# Altium schematic sheet USB 3.SchDoc
size 420 x 297 mm; SheetNumber: 6; SheetTotal: 7
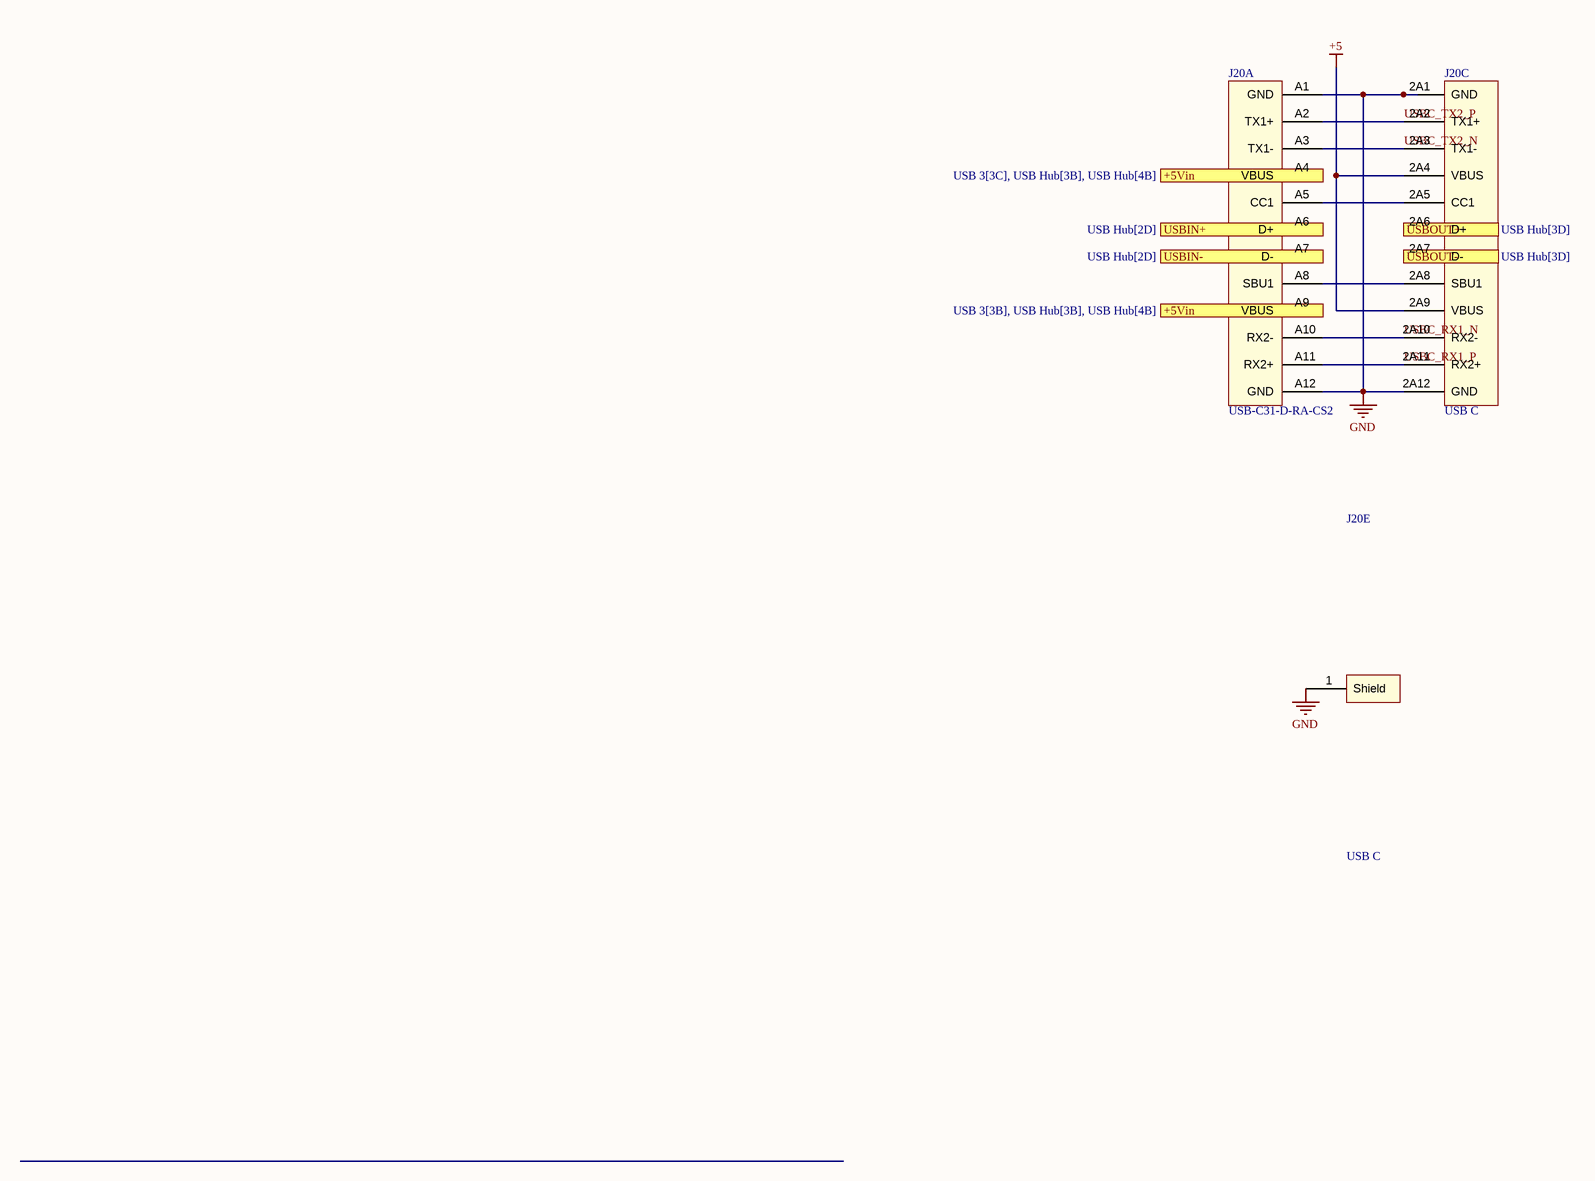
[diagram p0: USB 3.SchDoc]

## Parts
J20  USB-C31-D-RA-CS2  [Dual USB C Connector]  (parts A,C,E of 5)

## Ports
+5Vin (see USB 3[3B], USB Hub[3B], USB Hub[4B]), +5Vin (see USB 3[3C], USB Hub[3B], USB Hub[4B]), USBIN+ (see USB Hub[2D]), USBIN- (see USB Hub[2D]), USBOUT+ (see USB Hub[3D]), USBOUT- (see USB Hub[3D])

## Nets
+5: J20.2A4(VBUS) J20.2A9(VBUS)
GND: J20.1(Shield) J20.2A1(GND) J20.2A12(GND) J20.A1(GND) J20.A12(GND)
+5Vin: J20.A4(VBUS) J20.A9(VBUS) ; port +5Vin
USBC_RX1_N: J20.2A10(RX2-) J20.A10(RX2-)
USBC_RX1_P: J20.2A11(RX2+) J20.A11(RX2+)
USBC_TX2_N: J20.2A3(TX1-) J20.A3(TX1-)
USBC_TX2_P: J20.2A2(TX1+) J20.A2(TX1+)
USBIN+: J20.A6(D+) ; port USBIN+
USBIN-: J20.A7(D-) ; port USBIN-
USBOUT+: J20.2A6(D+) ; port USBOUT+
USBOUT-: J20.2A7(D-) ; port USBOUT-
NetJ20_2A5: J20.2A5(CC1) J20.A5(CC1)
NetJ20_2A8: J20.2A8(SBU1) J20.A8(SBU1)

## Notes on the sheet
- CREATIVE COMMONS
- PUBLIC LICENSE:
- BARKOUR ROBOT
- CC BY-NC 4.0
- APPROVED
- DWG NO
- GOOGLE LLC
- FILE
- RELEASED
- 2024/05/09
- SIZE
- 1600 AMPHITHEATRE PARKWAY
- MOUNTAIN VIEW CA 94043
- A3
- SHEET
- OF
- THIS DESIGN IS BEING PROVIDED  FOR NON-COMMERCIAL USE ONLY. THE USE OF =SCIENTIST_NAME_POSSESSIVE NAME IN CONNECTION WITH THE DESIGN IS NOT INTENDED TO IMPLY THAT =SCIENTIST_NAME SPONSORS OR ENDORSES THE DESIGN, GOOGLE LLC, OR ANY OF GOOGLE LLC'S PRODUCTS OR SERVICES.

## Library data of the parts
J20 = USB C: Dual USB C Connector